# EAGLE schematic lab1 (EAGLE 8.4.0)
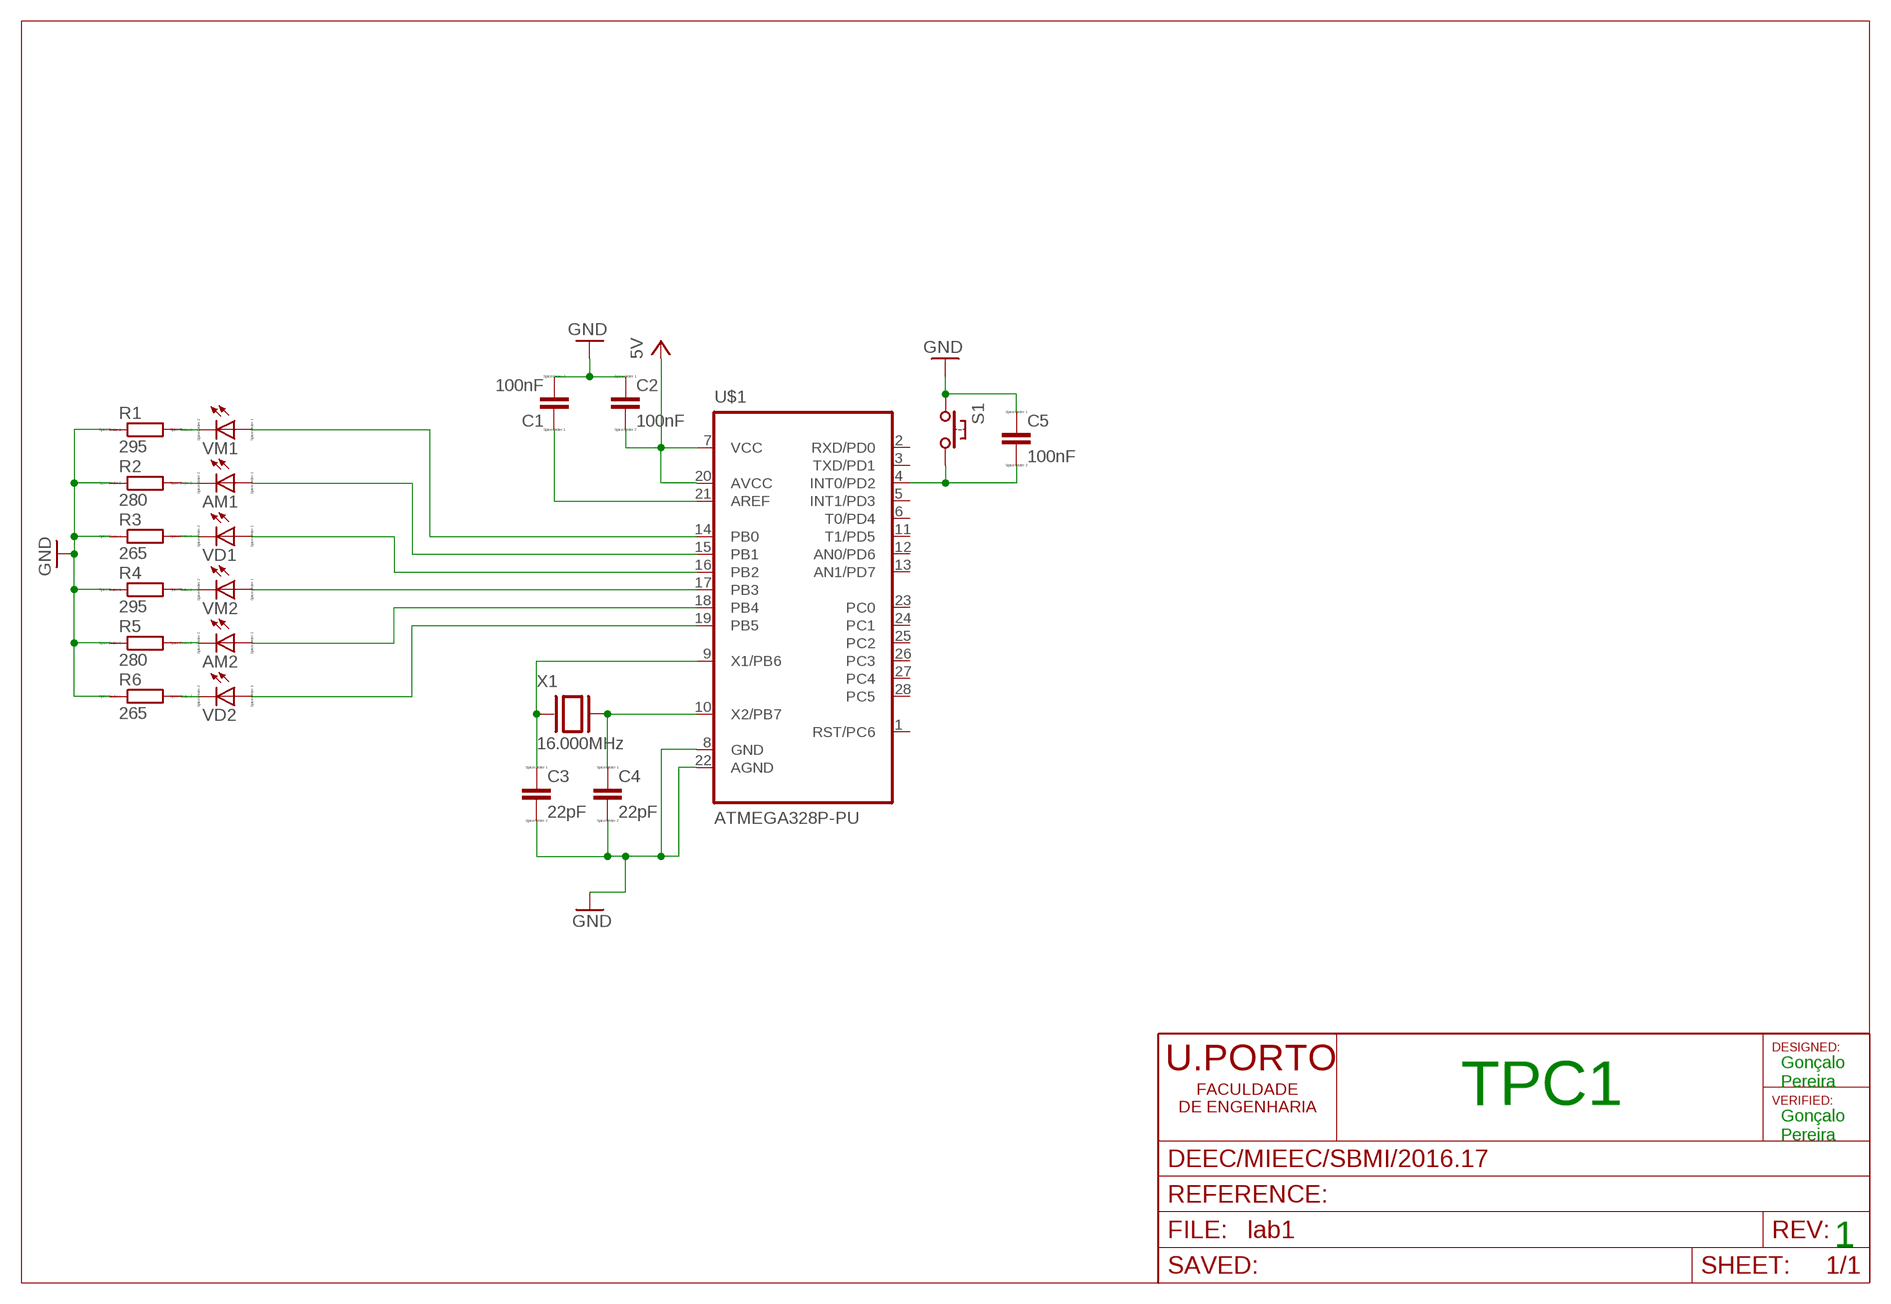
[diagram p0: schematic, sheet 1]

## Parts
AM1  LED_ELD260  [LED_LD260]
AM2  LED_ELD260  [LED_LD260]
C1  100nF  C  [C0805]
C2  100nF  C  [C0805]
C3  22pF  C  [C0805]
C4  22pF  C  [C0805]
C5  100nF  C  [C0805]
R1  295  R0204/7  [0204/7]
R2  280  R0204/7  [0204/7]
R3  265  R0204/7  [0204/7]
R4  295  R0204/7  [0204/7]
R5  280  R0204/7  [0204/7]
R6  265  R0204/7  [0204/7]
S1  PBUTTON  [B3F-31XX]
U$1  ATMEGA328P-PU  [PDIP28]
VD1  LED_ELD260  [LED_LD260]
VD2  LED_ELD260  [LED_LD260]
VM1  LED_ELD260  [LED_LD260]
VM2  LED_ELD260  [LED_LD260]
X1  16.000MHz  XTAL  [Q]

## Nets
GND: C1.2 C2.1 C3.2 C4.2 C5.1 R1.1 R2.1 R3.1 R4.1 R5.1 R6.1 S1.1(P) U$1.8(GND) U$1.22(AGND)
N$1: R1.2 VM1.K(C)
N$2: U$1.14(PB0) VM1.A
N$3: AM1.A U$1.15(PB1)
N$4: U$1.16(PB2) VD1.A
N$5: U$1.17(PB3) VM2.A
N$6: AM2.A U$1.18(PB4)
N$8: U$1.19(PB5) VD2.A
N$9: AM1.K(C) R2.2
N$10: R3.2 VD1.K(C)
N$11: R4.2 VM2.K(C)
N$12: AM2.K(C) R5.2
N$13: R6.2 VD2.K(C)
N$14: C4.1 U$1.10(X2/PB7) X1.1
N$15: C3.1 U$1.9(X1/PB6) X1.2
N$16: C1.1 U$1.21(AREF)
N$17: C5.2 S1.2(S) U$1.4(INT0/PD2)
VCC: C2.2 U$1.7(VCC) U$1.20(AVCC) ; supply symbol labelled 5V
Unconnected: U$1.1(RST/PC6) U$1.2(RXD/PD0) U$1.3(TXD/PD1) U$1.5(INT1/PD3) U$1.6(T0/PD4) U$1.11(T1/PD5) U$1.12(AN0/PD6) U$1.13(AN1/PD7) U$1.23(PC0) U$1.24(PC1) U$1.25(PC2) U$1.26(PC3) U$1.27(PC4) U$1.28(PC5)

## Notes on the sheet
- Gonçalo
  Pereira
- TPC1
- Gonçalo
  Pereira
- 1

## Library data of the parts
AM1 AM2 VD1 VD2 VM1 VM2 = eagle-ltspice:LED_E: LED Source: http://www.osram.convergy.de Source: www.luxeon.com Source: www.kingbright.com; SPICEMODEL: NONE; SPICEPREFIX: D; SPICETYPE: diode
C1-C5 = eagle-ltspice:C: CAPACITOR, European symbol; SPICEMODEL: NONE; SPICEPREFIX: C
R1-R6 = eagle-ltspice:R: RESISTOR, European symbol; SPICEMODEL: NONE; SPICEPREFIX: R
S1 = sbmi:PBUTTON: OMRON SWITCH; MPN: B3F-3100; OC_FARNELL: 959704; OC_NEWARK: 36M3582
U$1 = sbmi:ATMEGA328P: ATmega328P AVR microcontroller by Atmel
X1 = sbmi:XTAL: CRYSTAL